# Altium schematic sheet [4]-CONNECTORS.SchDoc
size A4
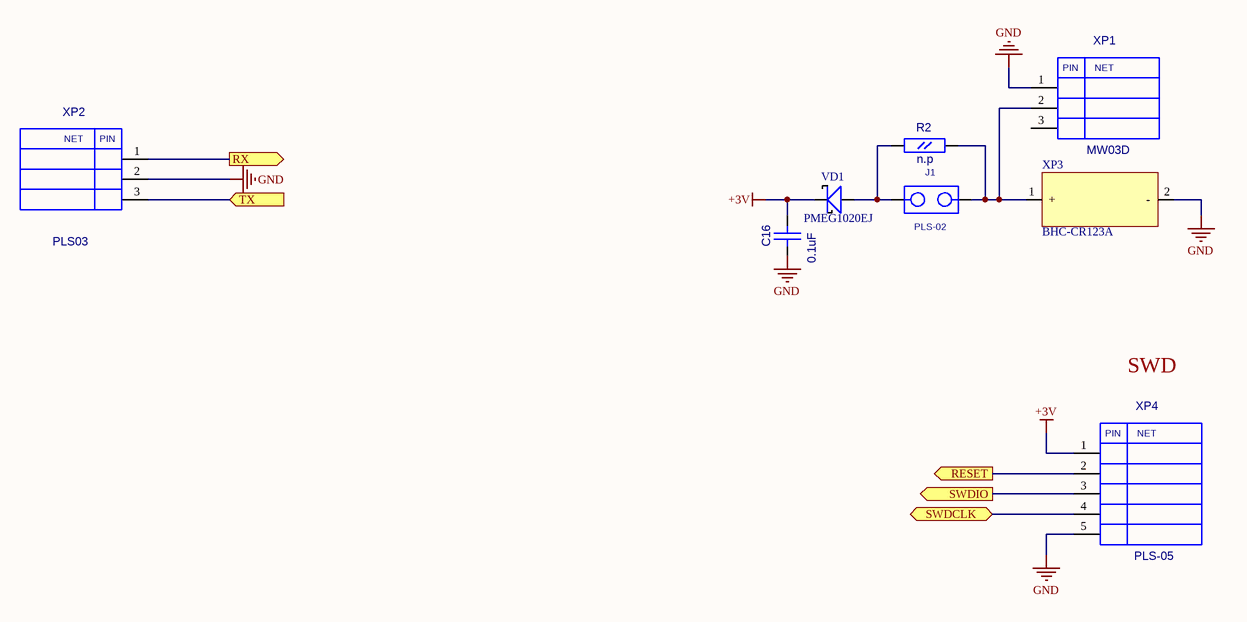
[diagram p0: [4]-CONNECTORS.SchDoc]

## Parts
C16  0.1uF  [CC0603]
J1  PLS-02  [PLS-02]
R2  n.p  [RC0603]
VD1  PMEG1020EJ  [SOD323]
XP1  MW03D  [MW03D]
XP2  PLS03  [PLS-03]
XP3  BHC-CR123A  [CR123_HOLDER]
XP4  PLS-05  [PLS-05]

## Ports
RESET (out), RX (out), SWDCLK (bidir), SWDIO (out), TX (in)

## Nets
+3V: C16.2(B) VD1.2(K) XP4.1
GND: C16.1(A) XP1.1 XP2.2 XP3.2(-) XP4.5
RESET: XP4.2 ; port RESET
RX: XP2.1 ; port RX
SWDCLK: XP4.4 ; port SWDCLK
SWDIO: XP4.3 ; port SWDIO
TX: XP2.3 ; port TX
NetJ1_1: J1.1 R2.1(A) VD1.1(A)
NetJ1_2: J1.2 R2.2(B) XP1.2 XP3.1(+)

Not connected (* = marked no-connect by the designer): XP1 3

## Notes on the sheet
- SWD
- (in symbol MW03D) PIN; NET
- (in symbol PLS03) NET; PIN
- (in symbol PLS-05) PIN; NET

## Library data of the parts
C16 = CC0603: Value: 0.1uF
R2 = RC0603: Value: n.p
VD1 = PMEG2010: Value: PMEG1020EJ
XP3 = BHC-CR123A: Holder for CR123 battery; Value: BHC-CR123A
J1 = PLS-02: Value: *
XP1 = MW03D: Value: *
XP2 = PLS03: Value: *
XP4 = PLS-05: Value: *